# Altium project RFTP1812.PrjPcb
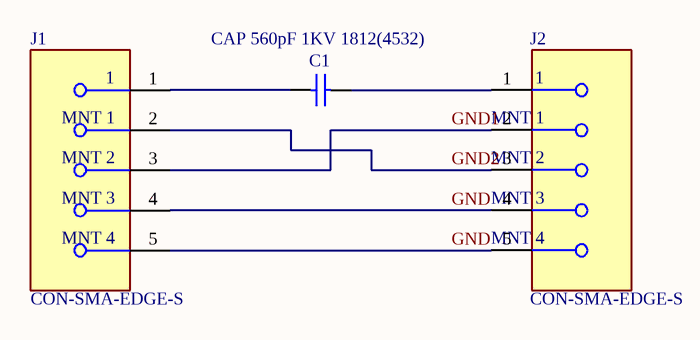
[diagram p0: RFTP1812.SchDoc]
1 sheet, 3 parts. Net scope: global (net labels, ports and power ports of the same name join across sheets).
Board file: RFTP1812.PcbDoc

## Sheet RFTP1812.SchDoc
size A; SheetNumber: 1; SheetTotal: 1

### Parts
C1  CAP 560pF 1KV 1812(4532)  [CAPC1812(4532)230_M]
J1  CON-SMA-EDGE-S  [FP-CON-SMA-EDGE-S-MFG]
J2  CON-SMA-EDGE-S  [FP-CON-SMA-EDGE-S-MFG]

### Nets
GND: J1.4(MNT_3) J1.5(MNT_4) J2.4(MNT_3) J2.5(MNT_4)
GND1: J1.3(MNT_2) J2.2(MNT_1)
GND2: J1.2(MNT_1) J2.3(MNT_2)
NetC1_1: C1.1 J1.1
NetC1_2: C1.2 J2.1

### Library data of the parts
C1 = CMP-1040-00227-1: CAP 560pF 1KV ±10% 1812 (4532 Metric) Thickness 2.3mm SMD; Case-EIA: 1812; Tolerance: Â±10%; Case-Metric: 4532; Technology: SMT; Rated Voltage: 1K V; Max Thickness: 2.3 mm; Value: 560pF
J1 J2 = CMP-204357-000001-1: CONN SMA JACK STR EDGE MNT; Manufacturer: RF Solutions Ltd.; Impedance: 50Ω; Conn Orientation: Right Angle; Is Female: yes; Number Of Contacts: 1; Frequency: 18GHz; Shielding: true; Category: Conn; ComponentLink2URL: https://www.rfsolutions.co.uk/downloads/1498648656DS-CON-EDGE-SMA-4.pdf; Octopart: https://octopart.com/con-sma-edge-s-rf+solutions-70967450; Package: CONN_JACK; Manufacturer Part Number: CON-SMA-EDGE-S; Height: 6.35mm; Device Class L1: Connectors; Footprint Url: https://forum.upverter.com/uploads/default/original/3X/b/e/be75b907af57498775929d6d9099689c472e0307.pdf; Contact Material: Gold; ComponentLink2Description: Datasheet; Device Class L2: RF / Coaxial Connectors; RoHS: TRUE; Device Class L3: unset; Digikey Description: CONN SMA JACK STR EDGE MNT; Lead Free: Yes; Automotive: No